# Altium schematic sheet Relay220VAC.SchDoc
size A4; DocumentNumber: 2; SheetNumber: 2; SheetTotal: 4
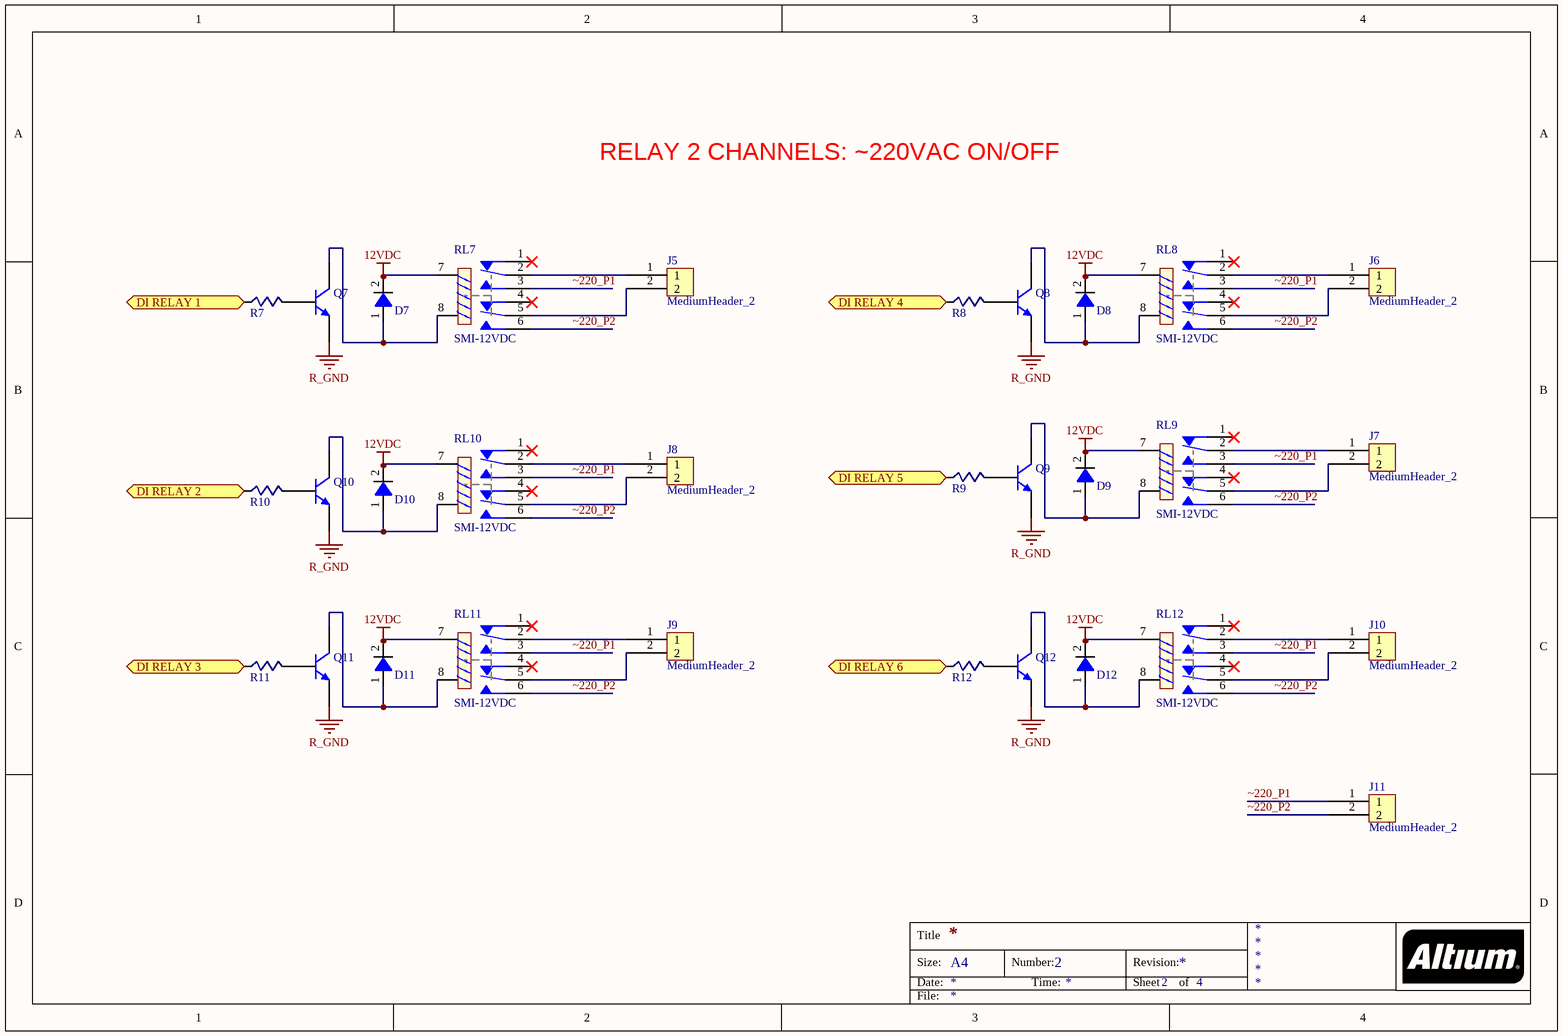
[diagram p0: Relay220VAC.SchDoc]

## Parts
D7  M7 SMD  [Diode 1N4007 SMD]  (value not drawn)
D8  M7 SMD  [Diode 1N4007 SMD]  (value not drawn)
D9  M7 SMD  [Diode 1N4007 SMD]  (value not drawn)
D10  M7 SMD  [Diode 1N4007 SMD]  (value not drawn)
D11  M7 SMD  [Diode 1N4007 SMD]  (value not drawn)
D12  M7 SMD  [Diode 1N4007 SMD]  (value not drawn)
J5  MediumHeader_2  [Medium - Header 2]
J6  MediumHeader_2  [Medium - Header 2]
J7  MediumHeader_2  [Medium - Header 2]
J8  MediumHeader_2  [Medium - Header 2]
J9  MediumHeader_2  [Medium - Header 2]
J10  MediumHeader_2  [Medium - Header 2]
J11  MediumHeader_2  [Medium - Header 2]
Q7  MMBT3904  [SOT23_L_MOD]  (value not drawn)
Q8  MMBT3904  [SOT23_L_MOD]  (value not drawn)
Q9  MMBT3904  [SOT23_L_MOD]  (value not drawn)
Q10  MMBT3904  [SOT23_L_MOD]  (value not drawn)
Q11  MMBT3904  [SOT23_L_MOD]  (value not drawn)
Q12  MMBT3904  [SOT23_L_MOD]  (value not drawn)
R7  R_1K_0603  [RES-SMD-0603]  (value not drawn)
R8  R_1K_0603  [RES-SMD-0603]  (value not drawn)
R9  R_1K_0603  [RES-SMD-0603]  (value not drawn)
R10  R_1K_0603  [RES-SMD-0603]  (value not drawn)
R11  R_1K_0603  [RES-SMD-0603]  (value not drawn)
R12  R_1K_0603  [RES-SMD-0603]  (value not drawn)
RL7  SMI-12VDC  [RELAY SMI-2P]
RL8  SMI-12VDC  [RELAY SMI-2P]
RL9  SMI-12VDC  [RELAY SMI-2P]
RL10  SMI-12VDC  [RELAY SMI-2P]
RL11  SMI-12VDC  [RELAY SMI-2P]
RL12  SMI-12VDC  [RELAY SMI-2P]

## Ports
DI RELAY 1, DI RELAY 2, DI RELAY 3, DI RELAY 4, DI RELAY 5, DI RELAY 6

## Nets
12VDC: D7.2 D8.2 D9.2 D10.2 D11.2 D12.2 RL7.7 RL8.7 RL9.7 RL10.7 RL11.7 RL12.7
R_GND: Q7.2(E) Q8.2(E) Q9.2(E) Q10.2(E) Q11.2(E) Q12.2(E)
DI RELAY 1: R7.1 ; port DI RELAY 1
DI RELAY 2: R10.1 ; port DI RELAY 2
DI RELAY 3: R11.1 ; port DI RELAY 3
DI RELAY 4: R8.1 ; port DI RELAY 4
DI RELAY 5: R9.1 ; port DI RELAY 5
DI RELAY 6: R12.1 ; port DI RELAY 6
~220_P1: J11.1 RL7.3 RL8.3 RL9.3 RL10.3 RL11.3 RL12.3
~220_P2: J11.2 RL7.6 RL8.6 RL9.6 RL10.6 RL11.6 RL12.6
NetD7_1: D7.1 Q7.3(C) RL7.8
NetD8_1: D8.1 Q8.3(C) RL8.8
NetD9_1: D9.1 Q9.3(C) RL9.8
NetD10_1: D10.1 Q10.3(C) RL10.8
NetD11_1: D11.1 Q11.3(C) RL11.8
NetD12_1: D12.1 Q12.3(C) RL12.8
NetJ5_1: J5.1 RL7.2
NetJ5_2: J5.2 RL7.5
NetJ6_1: J6.1 RL8.2
NetJ6_2: J6.2 RL8.5
NetJ7_1: J7.1 RL9.2
NetJ7_2: J7.2 RL9.5
NetJ8_1: J8.1 RL10.2
NetJ8_2: J8.2 RL10.5
NetJ9_1: J9.1 RL11.2
NetJ9_2: J9.2 RL11.5
NetJ10_1: J10.1 RL12.2
NetJ10_2: J10.2 RL12.5
NetQ7_1: Q7.1(B) R7.2
NetQ8_1: Q8.1(B) R8.2
NetQ9_1: Q9.1(B) R9.2
NetQ10_1: Q10.1(B) R10.2
NetQ11_1: Q11.1(B) R11.2
NetQ12_1: Q12.1(B) R12.2

Not connected (* = marked no-connect by the designer): RL7 1* 4*; RL8 1* 4*; RL9 1* 4*; RL10 1* 4*; RL11 1* 4*; RL12 1* 4*

## Notes on the sheet
- RELAY 2 CHANNELS: ~220VAC ON/OFF
- Title
- Size:
- Date:
- A4
- Number:
- Time:
- Revision:
- Sheet
- of
- File:

## Library data of the parts
D7-D12 = Diode_1N4007: DIODE GEN PURP 1KV 1A DO214AC; Supplier 1: Digi-Key; Supplier Part Number 1: 641-1018-1-ND
Q7-Q12 = MMBT3904: TRANSISTOR GP NPN AMP SOT-23; Published: 17-Sep-2003; LatestRevisionDate: 12-Dec-2006; LatestRevisionNote: IPC-7351 Footprint Added.; DatasheetVersion: 13-May-2002; PackageVersion: May-1999; PackageReference: SOT23; Publisher: Altium Limited; PackageDescription: 3-Pin SOT-23 Package 0.95 mm Pitch, 2.3 mm Lead Span; ComponentLink1Description: Manufacturer Link; ComponentLink1URL: http://www.semiconductors.philips.com/; ComponentLink2Description: Datasheet; ComponentLink2URL: http://www.semiconductors.philips.com/acrobat/datasheets/MMBT3904_4.pdf; Supplier 1: Digi-Key; Supplier Part Number 1: MMBT3904FSDKR-ND
R7-R12 = RES0603_1K: RES 1K OHM 1/10W 1% 0603 SMD; Supplier 1: Digi-Key; Supplier Part Number 1: 311-1.50KHRDKR-ND
RL7-RL12 = RELAY SMI-2P: Relay 12VDC, 2 channel